# Altium schematic sheet pca63557_sheet2_power_supply.SchDoc: =BoardTitle
size A4; Organization: Nordic Semiconductor; DocumentNumber: 2; SheetNumber: 2; SheetTotal: 4; CompanyName: Nordic Semiconductor; DocumentSize: A4
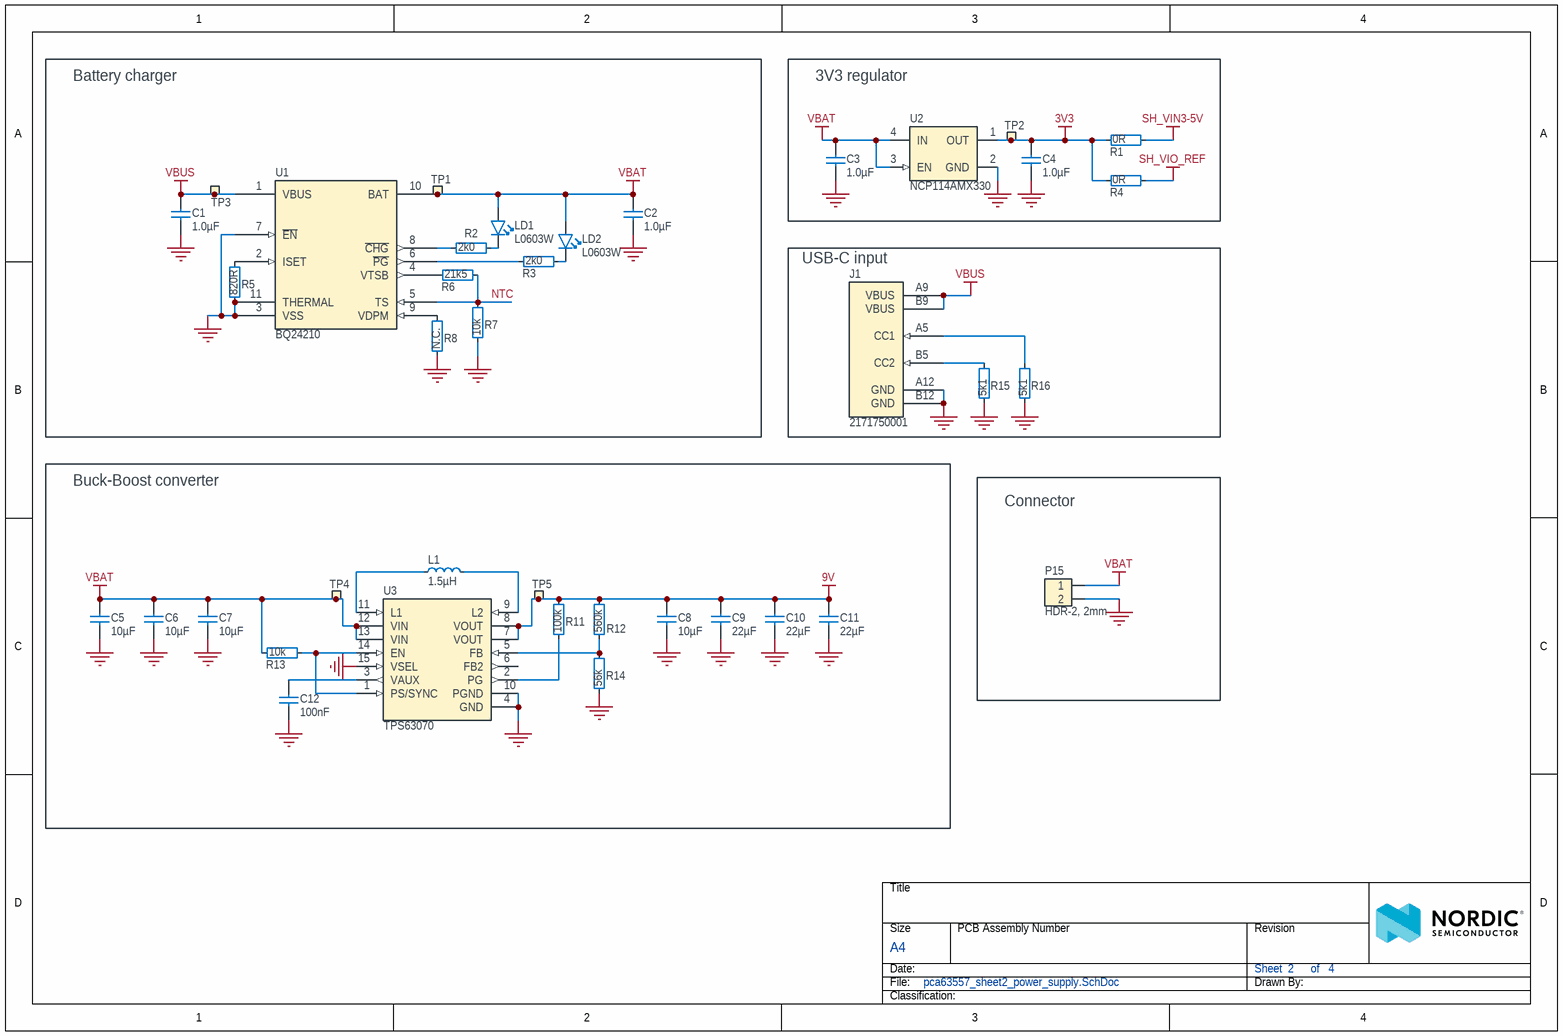
[diagram p0: pca63557_sheet2_power_supply.SchDoc]

## Parts
C1  1.0µF  [CAPC1005X04L]
C2  1.0µF  [CAPC1005X04L]
C3  1.0µF  [CAPC1005X04L]
C4  1.0µF  [CAPC1005X04L]
C5  10µF  [CAPC1608X06L]
C6  10µF  [CAPC1608X06L]
C7  10µF  [CAPC1608X06L]
C8  10µF  [CAPC1608X06L]
C9  22µF  [CAPC2012X11L]
C10  22µF  [CAPC2012X11L]
C11  22µF  [CAPC2012X11L]
C12  100nF  [CAPC1005X04L]
J1  2171750001  [2171750001]
L1  1.5µH  [XFL4020-152MEB]
LD1  L0603W  [LED_0603]
LD2  L0603W  [LED_0603]
P15  HDR-2, 2mm  [B 2B-PH-K-S]
R1  0R  [RESC1005X04L]
R2  2k0  [RESC1005X04L]
R3  2k0  [RESC1005X04L]
R4  0R  [RESC1005X04L]
R5  820R  [RESC1005X04L]
R6  21k5  [RESC1005X04L]
R7  10k  [RESC1005X04L]
R8  N.C.  [RESC1005X04L_NC]
R11  100k  [RESC1005X04L]
R12  560k  [RESC1608X06L]
R13  10k  [RESC1005X04L]
R14  56k  [RESC1608X06L]
R15  5k1  [RESC1005X04L]
R16  5k1  [RESC1005X04L]
TP1  Ø1.5mm,SMD  [TP_SMD_D1.5mm]  (value not drawn)  (no BOM)
TP2  Ø1.5mm,SMD  [TP_SMD_D1.5mm]  (value not drawn)  (no BOM)
TP3  Ø1.5mm,SMD  [TP_SMD_D1.5mm]  (value not drawn)  (no BOM)
TP4  Ø1.5mm,SMD  [TP_SMD_D1.5mm]  (value not drawn)  (no BOM)
TP5  Ø1.5mm,SMD  [TP_SMD_D1.5mm]  (value not drawn)  (no BOM)
U1  BQ24210  [BQ24210]
U2  NCP114AMX330  [UDFN65P100X100X60_HS-5N]
U3  TPS63070  [VQFN-HR50P250X300X100-15N]

## Blocks framed on the sheet
Battery charger: C1 C2 LD1 LD2 R2 R3 R5-R8 TP1 TP3 U1
3V3 regulator: C3 C4 R1 R4 TP2 U2
USB-C input: J1 R15 R16
Buck-Boost converter: C5-C12 L1 R11-R14 TP4 TP5 U3
Connector: P15

## Nets
3V3: C4.2 R1.1 R4.1 TP2.1 U2.1(OUT)
9V: C8.2 C9.2 C10.2 C11.2 R11.2 R12.2 TP5.1 U3.7(VOUT) U3.8(VOUT)
GND: C1.1 C2.1 C3.1 C4.1 C5.1 C6.1 C7.1 C8.1 C9.1 C10.1 C11.1 C12.1 J1.A12(GND) J1.B12(GND) P15.2 R5.1 R7.1 R8.1 R14.1 R15.1 R16.1 U1.3(VSS) U1.7(~{EN}) U1.11(THERMAL) U2.2(GND) U2.5(EPAD) U3.4(GND) U3.10(PGND) U3.15(VSEL)
SH_VIN3-5V: R1.2
SH_VIO_REF: R4.2
VBAT: C2.2 C3.2 C5.2 C6.2 C7.2 LD1.2(A) LD2.2(A) P15.1 R13.1 TP1.1 TP4.1 U1.10(BAT) U2.3(EN) U2.4(IN) U3.12(VIN) U3.13(VIN)
VBUS: C1.2 J1.A9(VBUS) J1.B9(VBUS) TP3.1 U1.1(VBUS)
NTC: R6.2 R7.2 U1.5(TS)
NetC12_2: C12.2 U3.3(VAUX)
NetJ1_A5: J1.A5(CC1) R16.2
NetJ1_B5: J1.B5(CC2) R15.2
NetL1_1: L1.1 U3.11(L1)
NetL1_2: L1.2 U3.9(L2)
NetLD1_1: LD1.1(C) R2.2
NetLD2_1: LD2.1(C) R3.2
NetR2_1: R2.1 U1.8(~{CHG})
NetR3_1: R3.1 U1.6(~{PG})
NetR5_2: R5.2 U1.2(ISET)
NetR6_1: R6.1 U1.4(VTSB)
NetR8_2: R8.2 U1.9(VDPM)
NetR11_1: R11.1 U3.2(PG)
NetR12_1: R12.1 R14.2 U3.5(FB)
NetR13_2: R13.2 U3.1(PS/SYNC) U3.14(EN)

Not connected (* = marked no-connect by the designer): U3 6(FB2)

## Notes on the sheet
- Title
- Size
- Date:
- File:
- A4
- PCB Assembly Number
- Sheet         of
- Drawn By:
- Revision
- Classification:

## Library data of the parts
C1 C2 = C0402-1µ0-25V-X5R: Capacitor, Ceramic, X5R, ±10%, 25V; Manufacturer: Murata; Manufacturer Part Number: GRM155R61E105KA12D; Part number NEMS: 100200453; Component Status: Active; Pad Count: 2; Artikkelnr Noca: N.A.; Part Number: C0402-1µ0-25V-X5R; PartId: 100200453; Component Class: Capacitors; Author: rsk; ComponentLink1URL: https://search.murata.co.jp/Ceramy/image/img/A01X/G101/ENG/GRM155R61E105KA12-01.pdf; ComponentLink1Description: Datasheet; ComponentLink2URL: https://www.murata.com/en-global/products/productdetail?partno=GRM155R61E105KA12%23; ComponentLink2Description: Supplier link; HelpURL: N.A.; Footprint Doc: 0402; LatestRevisionDate: 2020-12-16; Published: 2020-12-16; Value: 1.0µF; Note: 25V; Supplier 1: Digi-Key; Supplier Part Number 1: 490-10017-1-ND; Supplier 2: Mouser; Supplier Part Number 2: 81-GRM155R61E105KA2D; Part number IPS: N.A.; Part number Norautron: N.A.
C3 C4 = C0402-1µ0-10V-X5R: Capacitor, Ceramic, X5R, ±10%, 10V; Manufacturer: N.A.; Part number NEMS: 100200482; Component Status: Active; Pad Count: 2; Part Number: C0402-1µ0-10V-X5R; PartId: 100200482; Component Class: Capacitors; Author: rubr; Manufacturer Part Number: N.A.; ComponentLink1URL: N.A.; ComponentLink1Description: Datasheet; ComponentLink2URL: N.A.; ComponentLink2Description: Supplier link; HelpURL: N.A.; Footprint Doc: 0402; LatestRevisionDate: 2021-07-22; Published: 2021-07-22; Value: 1.0µF; Note: 10V; Supplier 1: N.A.; Supplier Part Number 1: N.A.; Supplier 2: N.A.; Supplier Part Number 2: N.A.; Artikkelnr Noca: N.A.; Part number IPS: N.A.; Part number Norautron: N.A.
C5-C8 = C0603-10µ-25V-X5R-CL10A106MA8NRNC: Capacitor, X5R, ±20%, 25V; Manufacturer: Samsung Electro-Mechanics America; Part number IPS: 00000009948; Part number Norautron: N.A.; Part number NEMS: 100200354; Component Status: Active; Pad Count: 2; Artikkelnr Noca: 20039436; Part Number: C0603-10µ-25V-X5R-CL10A106MA8NRNC; PartId: 100200354; Component Class: Capacitors; Author: rsk; Manufacturer Part Number: CL10A106MA8NRNC; ComponentLink1URL: N.A.; ComponentLink1Description: Datasheet; ComponentLink2URL: N.A.; ComponentLink2Description: Supplier link; HelpURL: http://www.samsungsem.com/kr/front/downloadcms.do?path=/kr/support/product-search/mlcc/__icsFiles/afieldfile/2014/11/05&fileName=S_CL10A106MA8NRNC.pdf; Footprint Doc: 0603; LatestRevisionDate: 2021-07-21; Published: 2015-04-10; Value: 10µF; Note: 25V; Supplier 1: Digi-Key; Supplier Part Number 1: 1276-1869-1-ND; Supplier 2: N.A.; Supplier Part Number 2: N.A.
C9-C11 = C0805-22µ-25V-X5R-CL21A226MAYNNWE: Capacitor, X5R, ±0.20%, 25V; Manufacturer: Samsung Electro-Mechanics; Component Status: Active; Pad Count: 2; Artikkelnr Noca: N.A.; Part Number: C0805-22µ-25V-X5R-CL21A226MAYNNWE; Component Class: Capacitors; Author: mam1; Manufacturer Part Number: CL21A226MAYNNWE; ComponentLink1URL: https://media.digikey.com/pdf/Data%20Sheets/Samsung%20PDFs/CL21A226MAYNNWE_Spec.pdfc; ComponentLink1Description: Datasheet; ComponentLink2URL: https://www.digikey.no/no/products/detail/samsung-electro-mechanics/CL21A226MAYNNWE/16344162; ComponentLink2Description: Supplier link; HelpURL: N.A.; Footprint Doc: 0805; LatestRevisionDate: 2022-06-23; Published: 2022-06-23; Value: 22µF; Note: 25V; Supplier 1: Digi-Key; Supplier Part Number 1: 1276-CL21A226MAYNNWECT-ND; Supplier 2: N.A.; Supplier Part Number 2: N.A.; Part number IPS: N.A.; Part number Norautron: N.A.
C12 = C0402-100n-50V: Capacitor, X5R, ±10%, 50V; Manufacturer: TDK Corporation; Manufacturer Part Number: C1005X5R1H104K050BB; Part number NEMS: 100200365; Component Status: Active; Pad Count: 2; Artikkelnr Noca: N.A.; Part Number: C0402-100n-50V; PartId: 100200365; Component Class: Capacitors; Author: rsk; ComponentLink1URL: N.A.; ComponentLink1Description: Datasheet; ComponentLink2URL: N.A.; ComponentLink2Description: Supplier link; HelpURL: http://www.tdk.com/pdf/TDKMLCCCapRange.pdf; Footprint Doc: 0402; LatestRevisionDate: 2020-10-13; Published: 2015-04-10; Value: 100nF; Note: 50V; Supplier 1: Digi-Key; Supplier Part Number 1: 445-5942-1-ND; Supplier 2: N.A.; Supplier Part Number 2: N.A.; Part number IPS: N.A.; Part number Norautron: N.A.
J1 = 2171750001: CONN RCP USB2.0 C 6POS SMD RA; Manufacturer: Molex; Part number NEMS: 100500750; Component Status: Active; Pad Count: 10; Note: N.A.; Supplier 1: Digi-Key; Manufacturer Part Number: 2171750001; RoHS: No; Category: Connectors; Stock 1: 6900; Pricing 1: 1000=0.50970, 2000=0.45860, 5000=0.41720, 10000=0.40300, 25000=0.38470 (USD); Part Number: 2171750001; PartId: 100500750; Component Class: Connectors; Author: mam1; ComponentLink1URL: https://www.molex.com/webdocs/datasheets/pdf/en-us/2171750001_IO_CONNECTORS.pdf; ComponentLink1Description: Datasheet; ComponentLink2URL: https://www.digikey.no/no/products/detail/molex/2171750001/13913745?s=N4IgTCBcDa4IwHZEFYAM64gLoF8g; ComponentLink2Description: Supplier link; HelpURL: N.A.; Footprint Doc: 2171750001; LatestRevisionDate: 2022-06-20; Published: 2022-06-15; Value: 2171750001; Supplier Part Number 1: 900-2171750001CT-ND; Supplier 2: N.A.; Supplier Part Number 2: N.A.; Artikkelnr Noca: N.A.; Part number IPS: N.A.; Part number Norautron: N.A.
L1 = XFL4020-152MEB: Fixed Inductors XFL4020 Low DCR Ind 1.5 uH 20 % 9.1 A; Manufacturer: Coilcraft; Part number NEMS: 100300153; Component Status: Active; Pad Count: 2; Note: N.A.; Part Number: XFL4020-152MEB; PartId: 100300153; Component Class: Inductors; Author: rsk; Manufacturer Part Number: XFL4020-152MEB; ComponentLink1URL: N.A.; ComponentLink1Description: Datasheet; ComponentLink2URL: N.A.; ComponentLink2Description: Supplier link; HelpURL: http://www.mouser.com/ds/2/597/xfl4020-270756.pdf; Footprint Doc: XFL4020-152MEB; LatestRevisionDate: 2015-09-25; Published: 2015-09-25; Value: 1.5µH; Supplier 1: Mouser; Supplier Part Number 1: 994-XFL4020-152MEB; Supplier 2: N.A.; Supplier Part Number 2: N.A.; Artikkelnr Noca: N.A.; Part number IPS: N.A.; Part number Norautron: N.A.
LD1 LD2 = 19-213/W1D: LED 0603, 19-213/W1D; Manufacturer: Everlight; Manufacturer Part Number: N.A.; Part number NEMS: 101400001; Component Status: Active; Pad Count: 2; Note: 45 mcd; Part Number: 19-213/W1D; PartId: 101400001; Component Class: Optoelectronics; Author: rsk; ComponentLink1URL: N.A.; ComponentLink1Description: Datasheet; ComponentLink2URL: N.A.; ComponentLink2Description: Supplier link; HelpURL: N.A.; Footprint Doc: 0603; LatestRevisionDate: 2009-05-18; Published: 2009-05-18; Value: L0603W; Supplier 1: N.A.; Supplier Part Number 1: N.A.; Supplier 2: N.A.; Supplier Part Number 2: N.A.; Artikkelnr Noca: N.A.; Part number IPS: N.A.; Part number Norautron: N.A.
P15 = B2B-PH-K-S: JST-B2B-PH-K-S (LF)(SN)-HEADER-BIDE ENTRY, 2WAY; Manufacturer: JST Sales America Inc.; Part number NEMS: 100500025; Component Status: Active; Pad Count: 2; Note: JST, Header; Artikkelnr Noca: N.A.; Assembly: DNM; Part Number: B2B-PH-K-S; PartId: 100500025; Component Class: Connectors; Author: rsk; Manufacturer Part Number: B2B-PH-K-S (LF)(SN); ComponentLink1URL: N.A.; ComponentLink1Description: Datasheet; ComponentLink2URL: N.A.; ComponentLink2Description: Supplier link; HelpURL: http://www.farnell.com/datasheets/80560.pdf; Footprint Doc: B 2B-PH-K-S; LatestRevisionDate: 2010-02-02; Published: 2010-02-02; Value: HDR-2, 2mm; Supplier 1: Farnell; Supplier Part Number 1: 949-1856; Supplier 2: N.A.; Supplier Part Number 2: N.A.; Part number IPS: N.A.; Part number Norautron: N.A.
R1 R4 = R0402-0R: Resistor, ±5%, 0.063W; Manufacturer: N.A.; Part number IPS: 00000007128; Part number NEMS: 100100109; Component Status: Active; Pad Count: 2; Note: Chip Res 5%; Artikkelnr Noca: 27049000; Part Number: R0402-0R; PartId: 100100109; Component Class: Resistors; Author: rsk; Manufacturer Part Number: N.A.; ComponentLink1URL: N.A.; ComponentLink1Description: Datasheet; ComponentLink2URL: N.A.; ComponentLink2Description: Supplier link; HelpURL: N.A.; Footprint Doc: 0402; LatestRevisionDate: 2009-11-23; Published: 2009-05-08; Value: 0R; Supplier 1: Farnell; Supplier Part Number 1: 146-9661; Supplier 2: N.A.; Supplier Part Number 2: N.A.; Part number Norautron: N.A.
R2 R3 = R0402-2k0: Resistor, ±1%, 0.063W; Manufacturer: N.A.; Part number NEMS: 100100181; Component Status: Active; Pad Count: 2; Note: Chip Res 1%; Artikkelnr Noca: 27049080; Part Number: R0402-2k0; PartId: 100100181; Component Class: Resistors; Author: rsk; Manufacturer Part Number: N.A.; ComponentLink1URL: N.A.; ComponentLink1Description: Datasheet; ComponentLink2URL: N.A.; ComponentLink2Description: Supplier link; HelpURL: N.A.; Footprint Doc: 0402; LatestRevisionDate: 2016-06-02; Published: 2016-05-09; Value: 2k0; Supplier 1: N.A.; Supplier Part Number 1: N.A.; Supplier 2: N.A.; Supplier Part Number 2: N.A.; Part number IPS: N.A.; Part number Norautron: N.A.
R5 = R0402-820: Resistor, ±1%, 0.063W; Manufacturer: N.A.; Part number NEMS: 100100168; Component Status: Active; Pad Count: 2; Note: Chip Res 1%; Artikkelnr Noca: 27049071; Part Number: R0402-820; PartId: 100100168; Component Class: Resistors; Author: rsk; Manufacturer Part Number: N.A.; ComponentLink1URL: N.A.; ComponentLink1Description: Datasheet; ComponentLink2URL: N.A.; ComponentLink2Description: Supplier link; HelpURL: N.A.; Footprint Doc: 0402; LatestRevisionDate: 2009-11-23; Published: 2009-05-08; Value: 820R; Supplier 1: Farnell; Supplier Part Number 1: 173-8849; Supplier 2: N.A.; Supplier Part Number 2: N.A.; Part number IPS: N.A.; Part number Norautron: N.A.
R6 = R0402-21k5: Resistor, ±1%, 0.063W; Manufacturer: N.A.; Part number NEMS: 100100211; Component Status: Active; Pad Count: 2; Note: Chip Res 1%; Part Number: R0402-21k5; PartId: 100100211; Component Class: Resistors; Author: rsk; Manufacturer Part Number: N.A.; ComponentLink1URL: N.A.; ComponentLink1Description: Datasheet; ComponentLink2URL: N.A.; ComponentLink2Description: Supplier link; HelpURL: N.A.; Footprint Doc: 0402; LatestRevisionDate: 2015-10-20; Published: 2015-10-20; Value: 21k5; Supplier 1: N.A.; Supplier Part Number 1: N.A.; Supplier 2: N.A.; Supplier Part Number 2: N.A.; Artikkelnr Noca: N.A.; Part number IPS: N.A.; Part number Norautron: N.A.
R7 R13 = R0402-10k: Resistor, ±1%, 0.063W; Manufacturer: N.A.; Part number IPS: 00000002093; Part number NEMS: 100100198; Component Status: Active; Pad Count: 2; Note: Chip Res 1%; Artikkelnr Noca: 27049097; Part Number: R0402-10k; PartId: 100100198; Component Class: Resistors; Author: rsk; Manufacturer Part Number: N.A.; ComponentLink1URL: N.A.; ComponentLink1Description: Datasheet; ComponentLink2URL: N.A.; ComponentLink2Description: Supplier link; HelpURL: N.A.; Footprint Doc: 0402; LatestRevisionDate: 2009-11-23; Published: 2009-05-08; Value: 10k; Supplier 1: Farnell; Supplier Part Number 1: 173-8864; Supplier 2: N.A.; Supplier Part Number 2: N.A.; Part number Norautron: N.A.
R8 = R0402-N.C.: Not mounted; Manufacturer: N.A.; Part number NEMS: 100100281; Component Status: Active; Pad Count: 2; Note: Chip Res; Assembly: Not mounted; Part Number: R0402-N.C.; PartId: 100100281; Component Class: Resistors; Author: rsk; Manufacturer Part Number: N.A.; ComponentLink1URL: N.A.; ComponentLink1Description: Datasheet; ComponentLink2URL: N.A.; ComponentLink2Description: Supplier link; HelpURL: N.A.; Footprint Doc: 0402; LatestRevisionDate: 2009-05-08; Published: 2009-05-08; Value: N.C.; Supplier 1: N.A.; Supplier Part Number 1: N.A.; Supplier 2: N.A.; Supplier Part Number 2: N.A.; Artikkelnr Noca: N.A.; Part number IPS: N.A.; Part number Norautron: N.A.
R11 = R0402-100k: Resistor, ±1%, 0.063W; Manufacturer: N.A.; Part number IPS: 00000003667; Part number NEMS: 100100239; Component Status: Active; Pad Count: 2; Note: Chip Res 1%; Artikkelnr Noca: 27049121; Part Number: R0402-100k; PartId: 100100239; Component Class: Resistors; Author: rsk; Manufacturer Part Number: N.A.; ComponentLink1URL: N.A.; ComponentLink1Description: Datasheet; ComponentLink2URL: N.A.; ComponentLink2Description: Supplier link; HelpURL: N.A.; Footprint Doc: 0402; LatestRevisionDate: 2009-11-23; Published: 2009-05-08; Value: 100k; Supplier 1: Farnell; Supplier Part Number 1: 173-8877; Supplier 2: N.A.; Supplier Part Number 2: N.A.; Part number Norautron: N.A.
R12 = R0603-560k: Resistor, ±1%, 0.06W; Manufacturer: N.A.; Part number NEMS: 100100357; Component Status: Active; Pad Count: 2; Note: Chip Res 1%; Artikkelnr Noca: 27069139; Part Number: R0603-560k; PartId: 100100357; Component Class: Resistors; Author: rsk; Manufacturer Part Number: N.A.; ComponentLink1URL: N.A.; ComponentLink1Description: Datasheet; ComponentLink2URL: N.A.; ComponentLink2Description: Supplier link; HelpURL: N.A.; Footprint Doc: 0603; LatestRevisionDate: 2011-08-16; Published: 2009-05-08; Value: 560k; Supplier 1: N.A.; Supplier Part Number 1: N.A.; Supplier 2: N.A.; Supplier Part Number 2: N.A.; Part number IPS: N.A.; Part number Norautron: N.A.
R14 = R0603-56k: Resistor, ±1%, 0.06W; Manufacturer: N.A.; Part number NEMS: 100100344; Component Status: Active; Pad Count: 2; Note: Chip Res 1%; Artikkelnr Noca: 27069115; Part Number: R0603-56k; PartId: 100100344; Component Class: Resistors; Author: rsk; Manufacturer Part Number: N.A.; ComponentLink1URL: N.A.; ComponentLink1Description: Datasheet; ComponentLink2URL: N.A.; ComponentLink2Description: Supplier link; HelpURL: N.A.; Footprint Doc: 0603; LatestRevisionDate: 2011-08-16; Published: 2009-05-08; Value: 56k; Supplier 1: N.A.; Supplier Part Number 1: N.A.; Supplier 2: N.A.; Supplier Part Number 2: N.A.; Part number IPS: N.A.; Part number Norautron: N.A.
R15 R16 = R0402-5k1: RES SMD 5.1K OHM 1% 1/10W 0402; Manufacturer: N.A.; Part number NEMS: 100100193; Component Status: Active; Pad Count: 2; Note: Chip Res 1%; Part Number: R0402-5k1; PartId: 100100193; Component Class: Resistors; Author: rsk; Manufacturer Part Number: N.A.; ComponentLink1URL: N.A.; ComponentLink1Description: Datasheet; ComponentLink2URL: N.A.; ComponentLink2Description: Supplier link; HelpURL: N.A.; Footprint Doc: 0402; LatestRevisionDate: 2009-04-16; Published: 2009-04-16; Value: 5k1; Supplier 1: N.A.; Supplier Part Number 1: N.A.; Supplier 2: N.A.; Supplier Part Number 2: N.A.; Artikkelnr Noca: N.A.; Part number IPS: N.A.; Part number Norautron: N.A.
TP1-TP5 = TP_SMD_Ø1.5MM: 1.5mm circular SMD testpad; Manufacturer: Nordic Semiconductor; Manufacturer Part Number: N.A.; Part number NEMS: 100500477; Component Status: Active; Pad Count: 1; Part Number: TP_SMD_Ø1.5MM; PartId: 100500477; Component Class: Connectors; Author: rsk; ComponentLink1URL: N.A.; ComponentLink1Description: Datasheet; ComponentLink2URL: N.A.; ComponentLink2Description: Supplier link; HelpURL: N.A.; Footprint Doc: TP_SMD_Ø1.5mm; LatestRevisionDate: 2021-03-05; Published: 2016-06-02; Value: Ø1.5mm,SMD; Note: N.A.; Supplier 1: N.A.; Supplier Part Number 1: N.A.; Supplier 2: N.A.; Supplier Part Number 2: N.A.; Artikkelnr Noca: N.A.; Part number IPS: N.A.; Part number Norautron: N.A.
U1 = BQ24210: IC BATT CHG LI-ION 1CELL 10WSON; Manufacturer: Texas Instruments; Component Status: Active; Pad Count: 11; Note: N.A.; Part Number: BQ24210; Component Class: Misc_ICs; Author: mam1; Manufacturer Part Number: BQ24210; ComponentLink1URL: https://www.ti.com/lit/ds/symlink/bq24210.pdf?HQS=dis-dk-null-digikeymode-dsf-pf-null-wwe&ts=1655977670459&ref_url=https%253A%252F%252Fwww.ti.com%252Fgeneral%252Fdocs%252Fsuppproductinfo.tsp%253FdistId%253D10%2526gotoUrl%253Dhttps%253A%252F%252Fwww.ti.com; ComponentLink1Description: Datasheet; ComponentLink2URL: https://www.digikey.no/no/products/detail/texas-instruments/BQ24210DQCR/2695894; ComponentLink2Description: Supplier link; HelpURL: N.A.; Footprint Doc: BQ24210; LatestRevisionDate: 2022-06-23; Published: 2022-06-21; Value: BQ24210; Supplier 1: Digi-Key; Supplier Part Number 1: 296-BQ24210DQCRCT-ND; Supplier 2: N.A.; Supplier Part Number 2: N.A.; Artikkelnr Noca: N.A.; Part number IPS: N.A.; Part number Norautron: N.A.
U2 = NCP114AMX330TBG: 300 mA CMOS Low Dropout Regulator; Manufacturer: ON Semiconductor; Part number NEMS: 101900525; Component Status: Active; Pad Count: 4; Note: N.A.; Part Number: NCP114AMX330TBG; PartId: 101900525; Component Class: Misc_ICs; Author: rsk; Manufacturer Part Number: NCP114AMX330TBG; ComponentLink1URL: http://www.onsemi.com/pub/Collateral/NCP114-D.PDF; ComponentLink1Description: Datasheet; ComponentLink2URL: N.A.; ComponentLink2Description: Supplier link; HelpURL: N.A.; Footprint Doc: UDFN-4; LatestRevisionDate: 2018-04-10; Published: 2018-04-10; Value: NCP114AMX330; Supplier 1: Digi-Key; Supplier Part Number 1: NCP114AMX330TBGOSCT-ND; Supplier 2: N.A.; Supplier Part Number 2: N.A.; Artikkelnr Noca: N.A.; Part number IPS: N.A.; Part number Norautron: N.A.
U3 = TPS63070RNMR: 2V to 16V Adjustable Buck-Boost Converter With 3.6-A Switch Current; Manufacturer: Texas Instruments; Part number NEMS: 101900487; Component Status: Active; Pad Count: 15; Note: N.A.; Part Number: TPS63070RNMR; PartId: 101900487; Component Class: Misc_ICs; Author: rsk; Manufacturer Part Number: TPS63070RNMR; ComponentLink1URL: N.A.; ComponentLink1Description: Datasheet; ComponentLink2URL: N.A.; ComponentLink2Description: Supplier link; HelpURL: http://www.ti.com/lit/ds/symlink/tps63070.pdf; Footprint Doc: VQFN-HR-15; LatestRevisionDate: 2017-06-10; Published: 2017-06-10; Value: TPS63070; Supplier 1: Digi-Key; Supplier Part Number 1: 296-44874-1-ND; Supplier 2: Mouser; Supplier Part Number 2: 595-TPS63070RNMR; Artikkelnr Noca: N.A.; Part number IPS: N.A.; Part number Norautron: N.A.